# Altium schematic sheet v1.0.SchDoc
size 109 x 55 mm
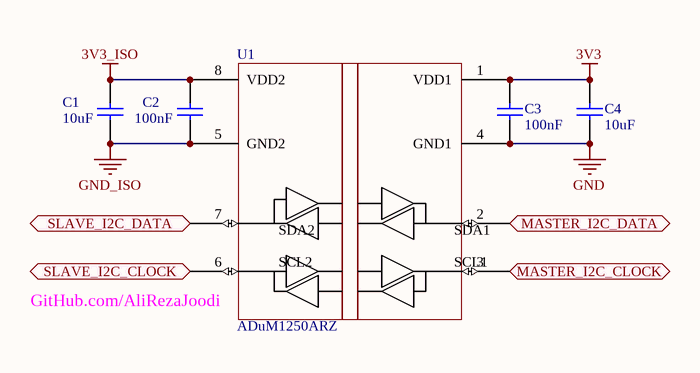
[diagram p0: v1.0.SchDoc]

## Parts
C1  10uF  [SMD_0805]
C2  100nF  [SMD_0805]
C3  100nF  [SMD_0805]
C4  10uF  [SMD_0805]
U1  ADuM1250ARZ

## Ports
MASTER_I2C_CLOCK, MASTER_I2C_DATA, SLAVE_I2C_CLOCK, SLAVE_I2C_DATA

## Nets
3V3: C3.2 C4.1 U1.1(VDD1)
3V3_ISO: C1.1 C2.2 U1.8(VDD2)
GND: C3.1 C4.2 U1.4(GND1)
GND_ISO: C1.2 C2.1 U1.5(GND2)
MASTER_I2C_CLOCK: U1.3(SCL1) ; port MASTER_I2C_CLOCK
MASTER_I2C_DATA: U1.2(SDA1) ; port MASTER_I2C_DATA
SLAVE_I2C_CLOCK: U1.6(SCL2) ; port SLAVE_I2C_CLOCK
SLAVE_I2C_DATA: U1.7(SDA2) ; port SLAVE_I2C_DATA

## Notes on the sheet
- (near U1) GitHub.com/AliRezaJoodi

## Library data of the parts
C1-C4 = Capacitor_Ceramic: Capacitor, Ceramic Multilayer; Revision: July-2002: Re-released for DXP Platform.
U1 = Isolator_ADuM1250: IC, Isolated I2C; 1_Manufacturer: Analog Devices; 1_Part Number: ADUM1250ARZ; 1_Link: https://eu.mouser.com/ProductDetail/Analog-Devices/ADUM1250ARZ?qs=WIvQP4zGangRfczfpyz2ew%3D%3D